# EAGLE schematic Relay_block_v1_circuit_diagram (EAGLE 9.7.0)
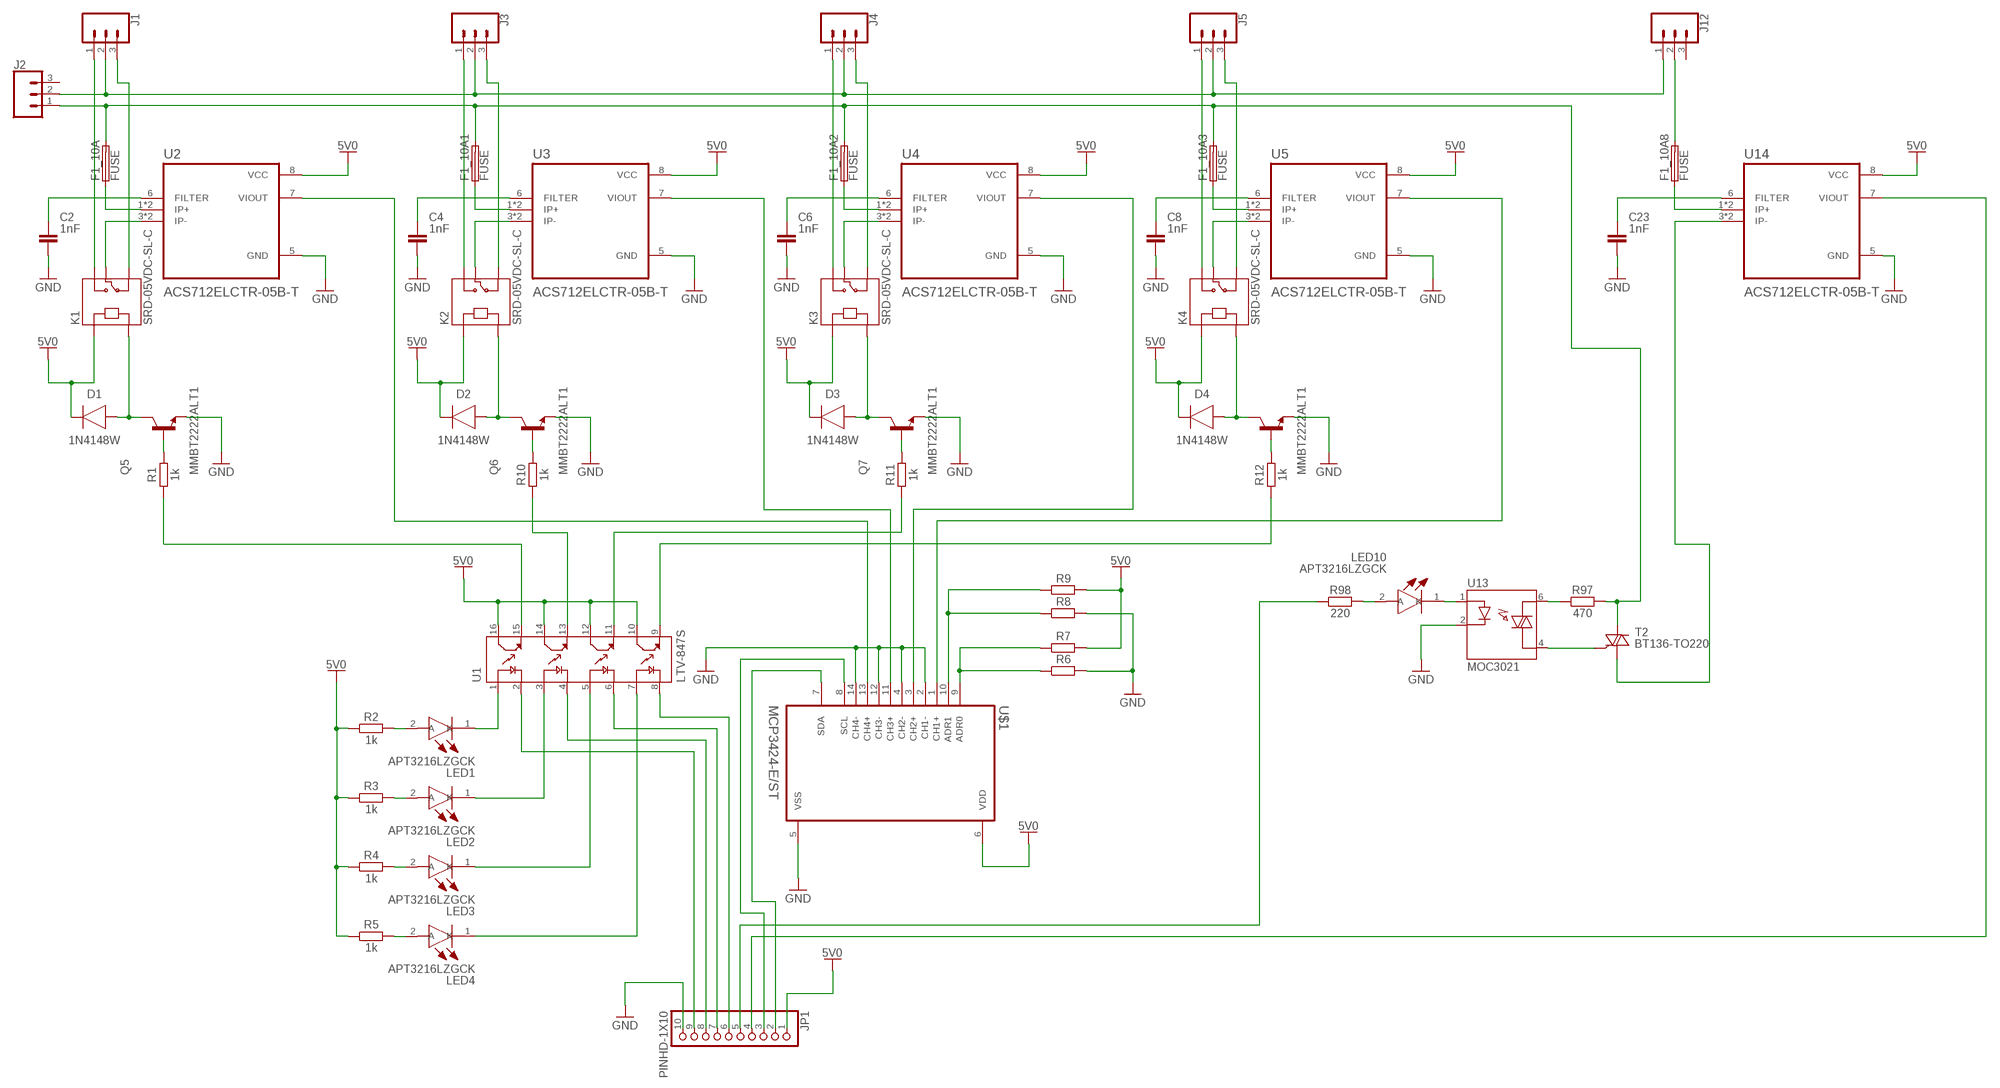
[diagram p0: schematic, sheet 1]

## Parts
C2  1nF  C_CHIP-1206(3216-METRIC)  [CAPC3216X135]
C4  1nF  C_CHIP-1206(3216-METRIC)  [CAPC3216X135]
C6  1nF  C_CHIP-1206(3216-METRIC)  [CAPC3216X135]
C8  1nF  C_CHIP-1206(3216-METRIC)  [CAPC3216X135]
C23  1nF  C_CHIP-1206(3216-METRIC)  [CAPC3216X135]
D1  1N4148W  DIODE_1N4148W-7-F_SOD123G  [SOD3715X135]
D2  1N4148W  DIODE_1N4148W-7-F_SOD123G  [SOD3715X135]
D3  1N4148W  DIODE_1N4148W-7-F_SOD123G  [SOD3715X135]
D4  1N4148W  DIODE_1N4148W-7-F_SOD123G  [SOD3715X135]
F1_10A  FUSE  FUSE_CHIP-1206(3216-METRIC)  [FUSC3215X82N]
F1_10A1  FUSE  FUSE_CHIP-1206(3216-METRIC)  [FUSC3215X82N]
F1_10A2  FUSE  FUSE_CHIP-1206(3216-METRIC)  [FUSC3215X82N]
F1_10A3  FUSE  FUSE_CHIP-1206(3216-METRIC)  [FUSC3215X82N]
F1_10A8  FUSE  FUSE_CHIP-1206(3216-METRIC)  [FUSC3215X82N]
J1  CONN_03-SCREW-5MM  [SCREWTERMINAL-5MM-3]
J2  CONN_03-SCREW-5MM  [SCREWTERMINAL-5MM-3]
J3  CONN_03-SCREW-5MM  [SCREWTERMINAL-5MM-3]
J4  CONN_03-SCREW-5MM  [SCREWTERMINAL-5MM-3]
J5  CONN_03-SCREW-5MM  [SCREWTERMINAL-5MM-3]
J12  CONN_03-SCREW-5MM  [SCREWTERMINAL-5MM-3]
JP1  PINHD-1X10  [1X10]
K1  SRD-05VDC-SL-C  [RELAY_SRD-05VDC-SL-C]
K2  SRD-05VDC-SL-C  [RELAY_SRD-05VDC-SL-C]
K3  SRD-05VDC-SL-C  [RELAY_SRD-05VDC-SL-C]
K4  SRD-05VDC-SL-C  [RELAY_SRD-05VDC-SL-C]
LED1  APT3216LZGCK  [LEDC3216X95N]
LED2  APT3216LZGCK  [LEDC3216X95N]
LED3  APT3216LZGCK  [LEDC3216X95N]
LED4  APT3216LZGCK  [LEDC3216X95N]
LED10  APT3216LZGCK  [LEDC3216X95N]
Q5  MMBT2222ALT1  [SOT95P237X111-3N]
Q6  MMBT2222ALT1  [SOT95P237X111-3N]
Q7  MMBT2222ALT1  [SOT95P237X111-3N]
Q8  MMBT2222ALT1  [SOT95P237X111-3N]
R1  1k  R_CHIP-1206(3216-METRIC)  [RESC3216X70]
R2  1k  R_CHIP-1206(3216-METRIC)  [RESC3216X70]
R3  1k  R_CHIP-1206(3216-METRIC)  [RESC3216X70]
R4  1k  R_CHIP-1206(3216-METRIC)  [RESC3216X70]
R5  1k  R_CHIP-1206(3216-METRIC)  [RESC3216X70]
R6  R_CHIP-1206(3216-METRIC)  [RESC3216X70]
R7  R_CHIP-1206(3216-METRIC)  [RESC3216X70]
R8  R_CHIP-1206(3216-METRIC)  [RESC3216X70]
R9  R_CHIP-1206(3216-METRIC)  [RESC3216X70]
R10  1k  R_CHIP-1206(3216-METRIC)  [RESC3216X70]
R11  1k  R_CHIP-1206(3216-METRIC)  [RESC3216X70]
R12  1k  R_CHIP-1206(3216-METRIC)  [RESC3216X70]
R97  470  R_CHIP-1206(3216-METRIC)  [RESC3216X70]
R98  220  R_CHIP-1206(3216-METRIC)  [RESC3216X70]
T2  BT136-TO220  [TO220AB]
U1  LTV-847S  [SOIC254P1016X460-16N]
U2  ACS712ELCTR-05B-T  [SOIC127P600X175-8N]
U3  ACS712ELCTR-05B-T  [SOIC127P600X175-8N]
U4  ACS712ELCTR-05B-T  [SOIC127P600X175-8N]
U5  ACS712ELCTR-05B-T  [SOIC127P600X175-8N]
U13  MOC3021  [DIP762W45P254L889H508Q6]
U14  ACS712ELCTR-05B-T  [SOIC127P600X175-8N]
U$1  MCP3424-E/ST  [SOP65P640X120-14N]

## Nets
5V0: D1.1(C) D2.1(C) D3.1(C) D4.1(C) JP1.1 K1.A1 K2.A1 K3.A1 K4.A1 R2.1 R3.1 R4.1 R5.1 R7.2 R9.2 U1.10(CT3) U1.12(CT2) U1.14(CT1) U1.16(CT) U2.8(VCC) U3.8(VCC) U4.8(VCC) U5.8(VCC) U14.8(VCC) U$1.6(VDD)
GND: C2.2 C4.2 C6.2 C8.2 C23.2 JP1.10 Q5.2(E) Q6.2(E) Q7.2(E) Q8.2(E) R6.2 R8.2 U2.5(GND) U3.5(GND) U4.5(GND) U5.5(GND) U13.2(CATODE) U14.5(GND) U$1.2(CH1-) U$1.4(CH2-) U$1.5(VSS) U$1.12(CH3-) U$1.14(CH4-)
N$1: LED2.2(A) R3.2
N$2: R1.1 U1.15(ET)
N$3: Q5.1(B) R1.2
N$4: K1.COM U2.3(IP-) U2.4(IP-)
N$5: LED1.2(A) R2.2
N$6: LED1.1(K) U1.1(A)
N$7: LED2.1(K) U1.3(A1)
N$8: LED3.2(A) R4.2
N$9: LED3.1(K) U1.5(A2)
N$10: LED4.2(A) R5.2
N$11: LED4.1(K) U1.7(A3)
N$12: D1.2(A) K1.A2 Q5.3(C)
N$13: C2.1 U2.6(FILTER)
N$14: F1_10A.1 U2.1(IP+) U2.2(IP+)
N$15: JP1.6 U1.8(C3)
N$16: J1.3 K1.NC
N$17: J1.1 K1.NO
N$18: JP1.7 U1.6(C2)
N$19: JP1.2 U$1.7(SDA)
N$20: J1.2 J2.2 J3.2 J4.2 J5.2 J12.1
N$21: R8.1 R9.1 U$1.10(ADR1)
N$22: R6.1 R7.1 U$1.9(ADR0)
N$23: Q6.1(B) R10.2
N$24: D2.2(A) K2.A2 Q6.3(C)
N$25: R10.1 U1.13(ET1)
N$26: K2.COM U3.3(IP-) U3.4(IP-)
N$27: C4.1 U3.6(FILTER)
N$28: F1_10A1.1 U3.1(IP+) U3.2(IP+)
N$29: J3.3 K2.NC
N$30: J3.1 K2.NO
N$31: JP1.5 R98.1
N$32: JP1.8 U1.4(C1)
N$33: Q7.1(B) R11.2
N$34: D3.2(A) K3.A2 Q7.3(C)
N$35: R11.1 U1.11(ET2)
N$36: K3.COM U4.3(IP-) U4.4(IP-)
N$37: C6.1 U4.6(FILTER)
N$38: F1_10A2.1 U4.1(IP+) U4.2(IP+)
N$39: J4.3 K3.NC
N$40: J4.1 K3.NO
N$41: JP1.9 U1.2(C)
N$42: JP1.4 U14.7(VIOUT)
N$43: Q8.1(B) R12.2
N$44: D4.2(A) K4.A2 Q8.3(C)
N$45: R12.1 U1.9(ET3)
N$46: K4.COM U5.3(IP-) U5.4(IP-)
N$47: C8.1 U5.6(FILTER)
N$48: F1_10A3.1 U5.1(IP+) U5.2(IP+)
N$49: J5.3 K4.NC
N$50: J5.1 K4.NO
N$54: U2.7(VIOUT) U$1.13(CH4+)
N$55: U3.7(VIOUT) U$1.11(CH3+)
N$56: U4.7(VIOUT) U$1.3(CH2+)
N$57: U5.7(VIOUT) U$1.1(CH1+)
N$84: F1_10A1.2 F1_10A2.2 F1_10A3.2 F1_10A.2 J2.1 R97.2 T2.2(A2)
N$154: F1_10A8.2 J12.2
N$156: T2.1(A1) U14.3(IP-) U14.4(IP-)
N$189: T2.3(G) U13.4(MAIN_TERM2)
N$190: LED10.2(A) R98.2
N$191: LED10.1(K) U13.1(ANODE)
N$192: R97.1 U13.6(MAIN_TERM1)
N$193: JP1.3 U$1.8(SCL)
N$195: C23.1 U14.6(FILTER)
N$203: F1_10A8.1 U14.1(IP+) U14.2(IP+)
Unconnected: J2.3 J12.3

## Library data of the parts
C2 C4 C6 C8 C23 = Capacitor:C: Capacitor - Generic; CATEGORY: Capacitor
D1-D4 = Diode:DIODE_: Diode Rectifier - Popular parts; CATEGORY: Diode; DESCRIPTION: DIODE GEN PURP 100V 300MA SOD123; MANUFACTURER: Diodes Incorporated; SUB-CATEGORY: Rectifier
F1_10A F1_10A1-F1_10A3 F1_10A8 = Circuit-Protection:FUSE: Fuse - Generic; CATEGORY: Circuit-Protection; SUB-CATEGORY: Fuse
J1-J5 J12 = SparkFun-Connectors:CONN_03: Multi connection point. Often used as Generic Header-pin footprint for 0.1 inch spaced/style header connections On any of the 0.1 inch spaced packages, you can populate with these: Break Away Headers - Straight <https://www.sparkfun.com/products/116> (PRT-00116) Break Away Male Headers - Right Angle <https://www.sparkfun.com/products/553> (PRT-00553) Female Headers <https://www.sparkfun.com/products/115> (PRT-00115) Break Away Headers - Machine Pin <https://www.sparkfun.com/products/117> (PRT-00117) Break Away Female Headers - Swiss Machine Pin <https://www.sparkfun.com/products/743> (PRT-00743) Stackable Header - 3 Pin (Female, 0.1") <https://www.sparkfun.com/products/13875> (PRT-13875) For SCREWTERMINALS and SPRING TERMINALS visit here: Screw Terimnals on SparkFun.com <https://www.sparkfun.com/search/results?term=Screw+Terminals> (5mm/3.5mm/2.54mm spacing) This device is also useful as a general connection point to wire up your design to another part of your project. Our various solder wires solder well into these plated through hole pads. Hook-Up Wire - Assortment (Stranded, 22 AWG) <https://www.sparkfun.com/products/11375> (PRT-11375) Hook-Up Wire - Assortment (Solid Core, 22 AWG) <https://www.sparkfun.com/products/11367> (PRT-11367) View the entire wire category on our website here <https://www.sparkfun.com/categories/141> Special notes: Molex polarized connector foot print use with SKU : PRT-08232 with associated crimp pins and housings.; PROD_ID: CONN-10134; SF_SKU: PRT-08433
JP1 = Connector:PINHD-1X10: PIN HEADER; CATEGORY: CONNECTOR; SUB-CATEGORY: PIN-HEADER
K1-K4 = SRD-05VDC-SL-C:SRD-05VDC-SL-C: 5V Trigger Relay Module For Arduino And Raspberry Pi 5V Trigger Relay Module For Arduino And Raspberry Pi; MANUFACTURER: SONGLE RELAY; STANDARD: IPC-7251
LED1-LED4 LED10 = APT3216LZGCK:APT3216LZGCK: 3.2X1.6mm Low Current Green SMD LED; Water Clear; 525nm; 120 Viewing Angle Source: Datasheet <https://componentsearchengine.com/Datasheets/1/APT3216LZGCK.pdf>; ALLIED_NUMBER: 71056210; ALLIED_PRICE-STOCK: https://www.alliedelec.com/kingbright-apt3216lzgck/71056210/; DESCRIPTION: 3.2X1.6mm Low Current Green SMD LED; Water Clear; 525nm; 120 Viewing Angle; HEIGHT: 0.95mm; MANUFACTURER_NAME: Kingbright; MANUFACTURER_PART_NUMBER: APT3216LZGCK; MOUSER_PART_NUMBER: 604-APT3216LZGCK; MOUSER_PRICE-STOCK: https://www.mouser.com/Search/Refine.aspx?Keyword=604-APT3216LZGCK
Q5-Q8 = MMBT2222ALT1:MMBT2222ALT1: Trans NPN 40V 0.6A SOT23 Check prices <https://pricing.snapeda.com/parts/MMBT2222ALT1/ON%20Semiconductor/view-part?ref=eda>; AVAILABILITY: Warning; DESCRIPTION: Bipolar (BJT) Transistor NPN 40V 600mA 300MHz 225mW Surface Mount SOT-23-3 (TO-236); MF: ON Semiconductor; MP: MMBT2222ALT1; PACKAGE: SOT-23-3 ON Semiconductor; PRICE: None; PURCHASE-URL: https://pricing.snapeda.com/search/part/MMBT2222ALT1/?ref=eda
R1-R12 R97 R98 = Resistor:R: Resistor Fixed - Generic; CATEGORY: Resistor; SUB-CATEGORY: Fixed
T2 = BT136:BT136: Triac BT136 series E sensitive gate Source: http://www.nxp.com/acrobat_download/datasheets/BT136_SERIES_E_2.pdf Check prices <https://pricing.snapeda.com/parts/BT136/Rectron/view-part?ref=eda>; AVAILABILITY: Warning; DESCRIPTION: TRIAC Standard 600V 4A Surface Mount DPAK; MF: Rectron; MP: BT136; PACKAGE: TO-252-3 Rectron; PRICE: None; PURCHASE-URL: https://pricing.snapeda.com/search/part/BT136/?ref=eda
U1 = LTV-847S:LTV-847S: Optocoupler DC-IN 4-CH Transistor DC-OUT 16-Pin PDIP SMD; MANUFACTURER: LITE-ON Technology; MAXIMUM_PACKAGE_HEIGHT: 4.6 mm; PARTREV: January 2010; STANDARD: IPC 7351B
U2-U5 U14 = ACS712ELCTR-05B-T:ACS712ELCTR-05B-T
U13 = MOC3021:MOC3021: Optocoupler Triac AC-OUT 1-CH 400VDRM 6-Pin PDIP Check prices <https://pricing.snapeda.com/parts/MOC3021/Lite-On/view-part?ref=eda>; AVAILABILITY: Good; DESCRIPTION: Optoisolator Triac Output 5000Vrms 1 Channel 6-SMD; MF: Lite-On; MP: MOC3021; PACKAGE: DIP-6 Lite-On; PRICE: None; PURCHASE-URL: https://pricing.snapeda.com/search/part/MOC3021/?ref=eda
U$1 = MCP3424-E_ST:MCP3424-E/ST